# Altium schematic sheet Hammerhead - MAX11300 Analog Hub R1.1.SchDoc
size A; SheetNumber: 3
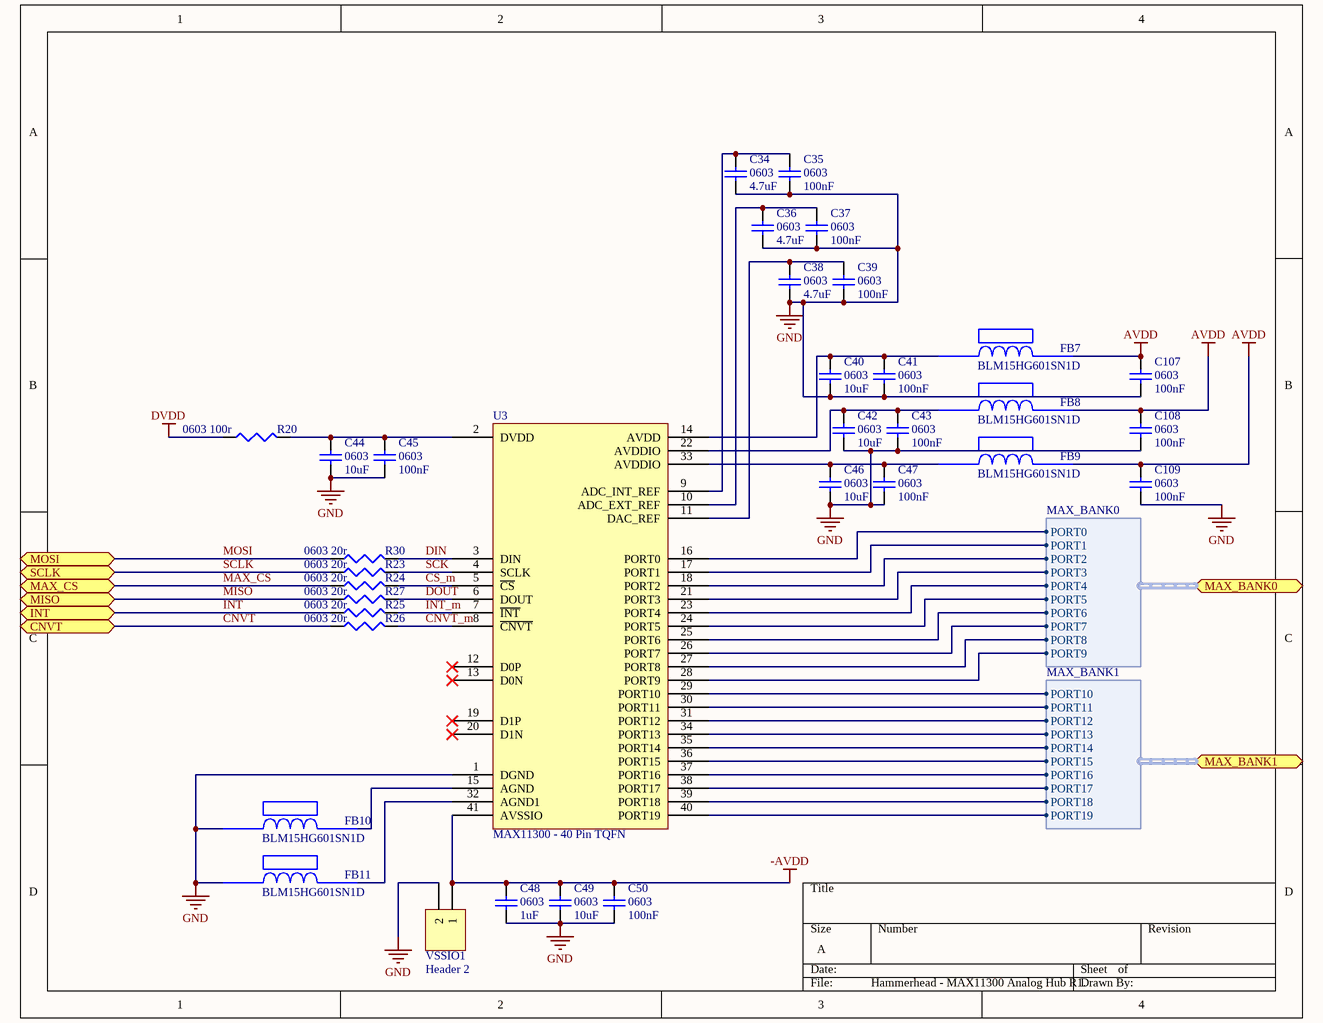
[diagram p0: Hammerhead - MAX11300 Analog Hub R1.1.SchDoc]

## Parts
C34  0603  value 4.7uF  [1608[0603]]
C35  0603  value 100nF  [1608[0603]]
C36  0603  value 4.7uF  [1608[0603]]
C37  0603  value 100nF  [1608[0603]]
C38  0603  value 4.7uF  [1608[0603]]
C39  0603  value 100nF  [1608[0603]]
C40  0603  value 10uF  [1608[0603]]
C41  0603  value 100nF  [1608[0603]]
C42  0603  value 10uF  [1608[0603]]
C43  0603  value 100nF  [1608[0603]]
C44  0603  value 10uF  [1608[0603]]
C45  0603  value 100nF  [1608[0603]]
C46  0603  value 10uF  [1608[0603]]
C47  0603  value 100nF  [1608[0603]]
C48  0603  value 1uF  [1608[0603]]
C49  0603  value 10uF  [1608[0603]]
C50  0603  value 100nF  [1608[0603]]
C107  0603  value 100nF  [1608[0603]]
C108  0603  value 100nF  [1608[0603]]
C109  0603  value 100nF  [1608[0603]]
FB7  BLM15HG601SN1D  [BLM18PG121SN1D]
FB8  BLM15HG601SN1D  [BLM18PG121SN1D]
FB9  BLM15HG601SN1D  [BLM18PG121SN1D]
FB10  BLM15HG601SN1D  [BLM18PG121SN1D]
FB11  BLM15HG601SN1D  [BLM18PG121SN1D]
R20  0603  value 100r  [J1-0603]
R23  0603  value 20r  [J1-0603]
R24  0603  value 20r  [J1-0603]
R25  0603  value 20r  [J1-0603]
R26  0603  value 20r  [J1-0603]
R27  0603  value 20r  [J1-0603]
R30  0603  value 20r  [J1-0603]
U3  MAX11300 - 40 Pin TQFN  [Maxim T4066+3 40 pin TQFN]
VSSIO1  Header 2  [HDR1X2]

## Ports
CNVT, INT, MAX_BANK0 (harness MAX_BANK0), MAX_BANK1 (harness MAX_BANK1), MAX_CS, MISO, MOSI, SCLK

## Harnesses
MAX_BANK0: PORT0, PORT1, PORT2, PORT3, PORT4, PORT5, PORT6, PORT7, PORT8, PORT9
MAX_BANK1: PORT19, PORT18, PORT17, PORT16, PORT15, PORT14, PORT13, PORT12, PORT11, PORT10

## Nets
-AVDD: C48.2 C49.2 C50.2 U3.41(AVSSIO) VSSIO1.1
AVDD: C107.2 C108.2 C109.2 FB7.2 FB8.2 FB9.2
DVDD: R20.1
GND: C34.1 C35.1 C36.1 C37.1 C38.1 C39.1 C40.1 C41.1 C42.1 C43.1 C44.1 C45.1 C46.1 C47.1 C48.1 C49.1 C50.1 C107.1 C108.1 C109.1 FB10.1 FB11.1 U3.1(DGND) VSSIO1.2
CNVT: R26.1 ; port CNVT
CNVT_m: R26.2 U3.8(~{CNVT})
CS_m: R24.2 U3.5(~{CS})
DIN: R30.2 U3.3(DIN)
DOUT: R27.2 U3.6(DOUT)
INT: R25.1 ; port INT
INT_m: R25.2 U3.7(~{INT})
MAX_CS: R24.1 ; port MAX_CS
MISO: R27.1 ; port MISO
MOSI: R30.1 ; port MOSI
SCK: R23.2 U3.4(SCLK)
SCLK: R23.1 ; port SCLK
NetC34_2: C34.2 C35.2 U3.9(ADC_INT_REF)
NetC36_2: C36.2 C37.2 U3.10(ADC_EXT_REF)
NetC38_2: C38.2 C39.2 U3.11(DAC_REF)
NetC40_2: C40.2 C41.2 FB7.1 U3.14(AVDD)
NetC42_2: C42.2 C43.2 FB8.1 U3.22(AVDDIO)
NetC44_2: C44.2 C45.2 R20.2 U3.2(DVDD)
NetC46_2: C46.2 C47.2 FB9.1 U3.33(AVDDIO)
NetFB10_2: FB10.2 U3.15(AGND)
NetFB11_2: FB11.2 U3.32(AGND1)
NetU3_16: U3.16(PORT0) ; port MAX_BANK0.PORT0
NetU3_17: U3.17(PORT1) ; port MAX_BANK0.PORT1
NetU3_18: U3.18(PORT2) ; port MAX_BANK0.PORT2
NetU3_21: U3.21(PORT3) ; port MAX_BANK0.PORT3
NetU3_23: U3.23(PORT4) ; port MAX_BANK0.PORT4
NetU3_24: U3.24(PORT5) ; port MAX_BANK0.PORT5
NetU3_25: U3.25(PORT6) ; port MAX_BANK0.PORT6
NetU3_26: U3.26(PORT7) ; port MAX_BANK0.PORT7
NetU3_27: U3.27(PORT8) ; port MAX_BANK0.PORT8
NetU3_28: U3.28(PORT9) ; port MAX_BANK0.PORT9
NetU3_29: U3.29(PORT10) ; port MAX_BANK1.PORT10
NetU3_30: U3.30(PORT11) ; port MAX_BANK1.PORT11
NetU3_31: U3.31(PORT12) ; port MAX_BANK1.PORT12
NetU3_34: U3.34(PORT13) ; port MAX_BANK1.PORT13
NetU3_35: U3.35(PORT14) ; port MAX_BANK1.PORT14
NetU3_36: U3.36(PORT15) ; port MAX_BANK1.PORT15
NetU3_37: U3.37(PORT16) ; port MAX_BANK1.PORT16
NetU3_38: U3.38(PORT17) ; port MAX_BANK1.PORT17
NetU3_39: U3.39(PORT18) ; port MAX_BANK1.PORT18
NetU3_40: U3.40(PORT19) ; port MAX_BANK1.PORT19

Not connected (* = marked no-connect by the designer): U3 12(D0P)* 13(D0N)* 19(D1P)* 20(D1N)*

## Library data of the parts
C34-C50 C107-C109 = Cap Semi: Capacitor (Semiconductor SIM Model); Published: 8-Jun-2000; LatestRevisionDate: 29-May-2009; LatestRevisionNote: IPC-7351 Footprint Added.; PackageReference: C1206; Publisher: Altium Limited; PackageDescription: Chip Capacitor
R20 R23-R27 R30 = Res3: Resistor; Published: 8-Jun-2000; LatestRevisionDate: 29-May-2009; LatestRevisionNote: IPC-7351 Footprint Added.; PackageReference: J1-0603; Publisher: Altium Limited; PackageDescription: Chip Resistor
U3 = MAX11300 - 40 Pin TQFN: MAX11300
VSSIO1 = Header 2: Header, 2-Pin; LatestRevisionDate: 17-Jul-2002; LatestRevisionNote: Re-released for DXP Platform.; Publisher: Altium Limited